# Altium project kovan test project.PrjPcb
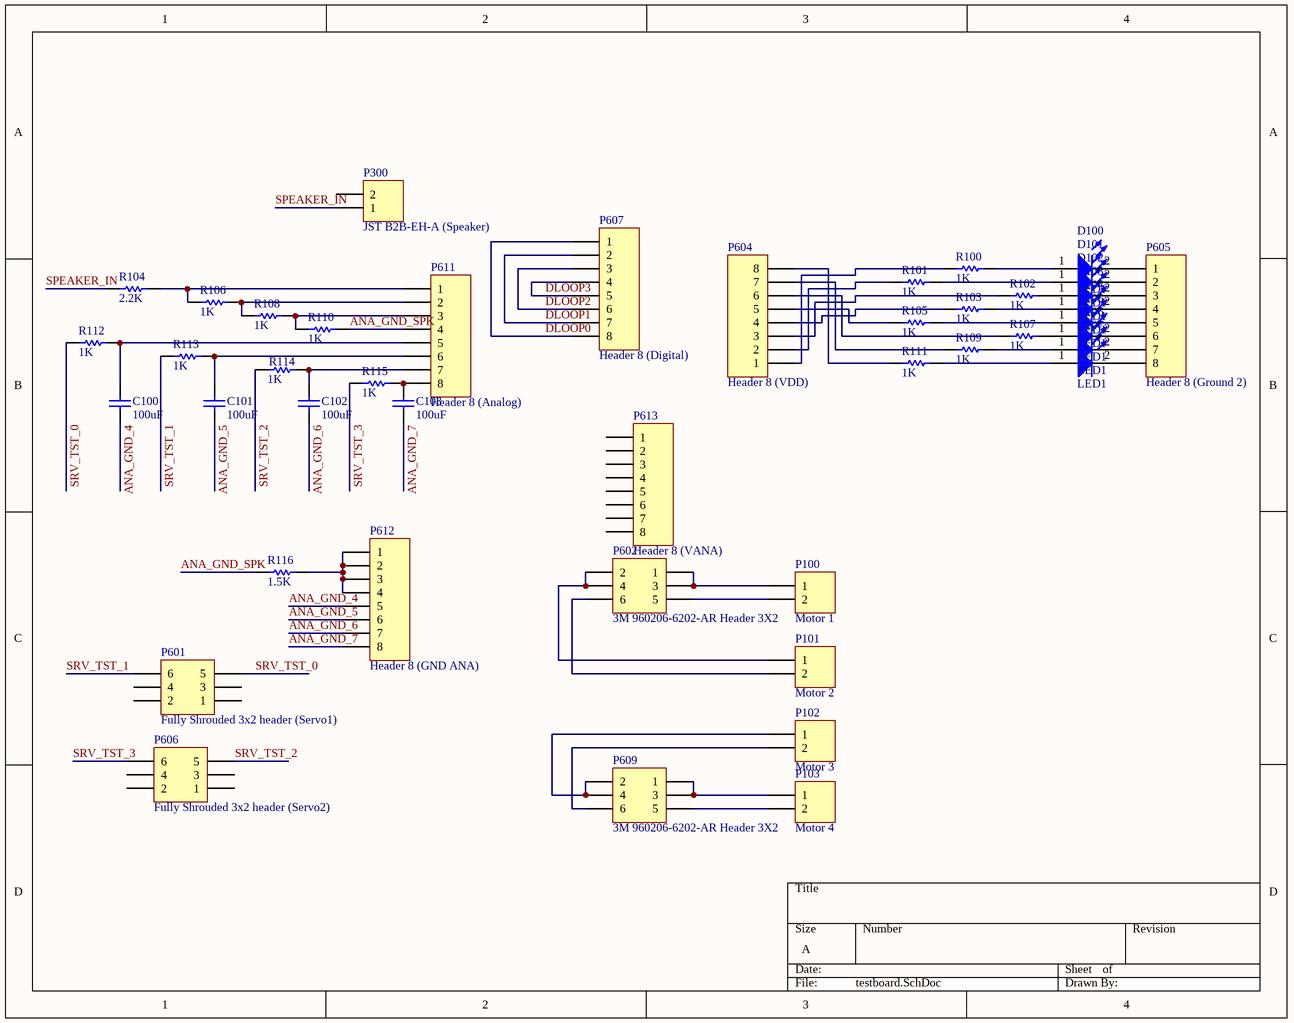
[diagram p0: testboard.SchDoc]
1 sheet, 44 parts. Net scope: global (net labels, ports and power ports of the same name join across sheets).
Board file: mainpcb.PcbDoc

## Sheet testboard.SchDoc
size A

### Parts
C100  100uF  [CAPPR5-5x5]
C101  100uF  [CAPPR5-5x5]
C102  100uF  [CAPPR5-5x5]
C103  100uF  [CAPPR5-5x5]
D100  LED1  [TLHG520]
D101  LED1  [TLHG520]
D102  LED1  [TLHG520]
D103  LED1  [TLHG520]
D104  LED1  [TLHG520]
D105  LED1  [TLHG520]
D106  LED1  [TLHG520]
D107  LED1  [TLHG520]
P100  Motor 1  [weidmuller_1716060000]
P101  Motor 2  [weidmuller_1716060000]
P102  Motor 3  [weidmuller_1716060000]
P103  Motor 4  [weidmuller_1716060000]
P300  JST B2B-EH-A (Speaker)  [JST_B2B_EH_A]
P601  Fully Shrouded 3x2 header (Servo1)  [HEADER2X3_SHROUDED]
P602  3M 960206-6202-AR Header 3X2  [HDR2X3]
P604  Header 8 (VDD)  [HDR1X8]
P605  Header 8 (Ground 2)  [HDR1X8]
P606  Fully Shrouded 3x2 header (Servo2)  [HEADER2X3_SHROUDED]
P607  Header 8 (Digital)  [HDR1X8]
P609  3M 960206-6202-AR Header 3X2  [HDR2X3]
P611  Header 8 (Analog)  [HDR1X8]
P612  Header 8 (GND ANA)  [HDR1X8]
P613  Header 8 (VANA)  [HDR1X8]
R100  1K  [AXIAL-0.3]
R101  1K  [AXIAL-0.3]
R102  1K  [AXIAL-0.3]
R103  1K  [AXIAL-0.3]
R104  2.2K  [AXIAL-0.3]
R105  1K  [AXIAL-0.3]
R106  1K  [AXIAL-0.3]
R107  1K  [AXIAL-0.3]
R108  1K  [AXIAL-0.3]
R109  1K  [AXIAL-0.3]
R110  1K  [AXIAL-0.3]
R111  1K  [AXIAL-0.3]
R112  1K  [AXIAL-0.3]
R113  1K  [AXIAL-0.3]
R114  1K  [AXIAL-0.3]
R115  1K  [AXIAL-0.3]
R116  1.5K  [AXIAL-0.3]

### Nets
ANA_GND_4: C100.1 P612.5
ANA_GND_5: C101.1 P612.6
ANA_GND_6: C102.1 P612.7
ANA_GND_7: C103.1 P612.8
ANA_GND_SPK: P611.4 R110.1 R116.1
DLOOP0: P607.1 P607.8
DLOOP1: P607.2 P607.7
DLOOP2: P607.3 P607.6
DLOOP3: P607.4 P607.5
SPEAKER_IN: P300.1 R104.2
SRV_TST_0: P601.5 R112.1
SRV_TST_1: P601.6 R113.1
SRV_TST_2: P606.5 R114.1
SRV_TST_3: P606.6 R115.1
NetC100_2: C100.2 P611.5 R112.2
NetC101_2: C101.2 P611.6 R113.2
NetC102_2: C102.2 P611.7 R114.2
NetC103_2: C103.2 P611.8 R115.2
NetD100_1: D100.1(A) R100.1
NetD100_2: D100.2(K) P605.1
NetD101_1: D101.1(A) R101.1
NetD101_2: D101.2(K) P605.2
NetD102_1: D102.1(A) R102.1
NetD102_2: D102.2(K) P605.3
NetD103_1: D103.1(A) R103.1
NetD103_2: D103.2(K) P605.4
NetD104_1: D104.1(A) R105.1
NetD105_1: D105.1(A) R107.1
NetD105_2: D105.2(K) P605.6
NetD106_1: D106.1(A) R109.1
NetD106_2: D106.2(K) P605.7
NetD107_1: D107.1(A) R111.1
NetD107_2: D107.2(K) P605.8
NetP100_1: P100.1 P602.1 P602.3
NetP100_2: P100.2 P602.5
NetP101_1: P101.1 P602.2 P602.4
NetP101_2: P101.2 P602.6
NetP102_1: P102.1 P609.2 P609.4
NetP102_2: P102.2 P609.6
NetP103_1: P103.1 P609.1 P609.3
NetP103_2: P103.2 P609.5
NetP604_1: P604.1 R100.2
NetP604_2: P604.2 R101.2
NetP604_3: P604.3 R102.2
NetP604_4: P604.4 R103.2
NetP604_5: P604.5 R105.2
NetP604_6: P604.6 R107.2
NetP604_7: P604.7 R109.2
NetP604_8: P604.8 R111.2
NetP611_1: P611.1 R104.1 R106.2
NetP611_2: P611.2 R106.1 R108.2
NetP611_3: P611.3 R108.1 R110.2
NetP612_1: P612.1 P612.2 P612.3 P612.4 R116.2

Not connected (* = marked no-connect by the designer): P300 2; P601 1 2 3 4; P605 5; P606 1 2 3 4; P613 1 2 3 4 5 6 7 8

### Library data of the parts
C100-C103 = Cap: Capacitor; pin to pad: 1>2 2>1; Published: 8-Jun-2000; LatestRevisionDate: 17-Jul-2002; LatestRevisionNote: Re-released for DXP Platform.; PackageReference: RAD-0.3; Publisher: Altium Limited; Value: 100uF
D100-D103 D105-D107 = LED1: Typical RED GaAs LED; pin to pad: 1>2 2>1; Published: 8-Jun-2000; LatestRevisionDate: 08-Jul-2005; LatestRevisionNote: Mech Layer 1 removed.; PackageReference: LED-1; Publisher: Altium Limited
D104 = LED1: Typical RED GaAs LED; pin to pad: 1>2; Published: 8-Jun-2000; LatestRevisionDate: 08-Jul-2005; LatestRevisionNote: Mech Layer 1 removed.; PackageReference: LED-1; Publisher: Altium Limited
P100-P103 P300 = Header 2: Header, 2-Pin; LatestRevisionDate: 17-Jul-2002; LatestRevisionNote: Re-released for DXP Platform.; Publisher: Altium Limited
P601 P602 P606 P609 = Header 3X2: Header, 3-Pin, Dual row; LatestRevisionDate: 17-Jul-2002; LatestRevisionNote: Re-released for DXP Platform.; Publisher: Altium Limited
P604 P605 P607 P611-P613 = Header 8: Header, 8-Pin; LatestRevisionDate: 17-Jul-2002; LatestRevisionNote: Re-released for DXP Platform.; Publisher: Altium Limited
R100-R116 = Res1: Resistor; Published: 8-Jun-2000; LatestRevisionDate: 17-Jul-2002; LatestRevisionNote: Re-released for DXP Platform.; PackageReference: AXIAL-0.3; Publisher: Altium Limited
  R100-R103 R105-R115: Value: 1K
  R104: Value: 2.2K
  R116: Value: 1.5K